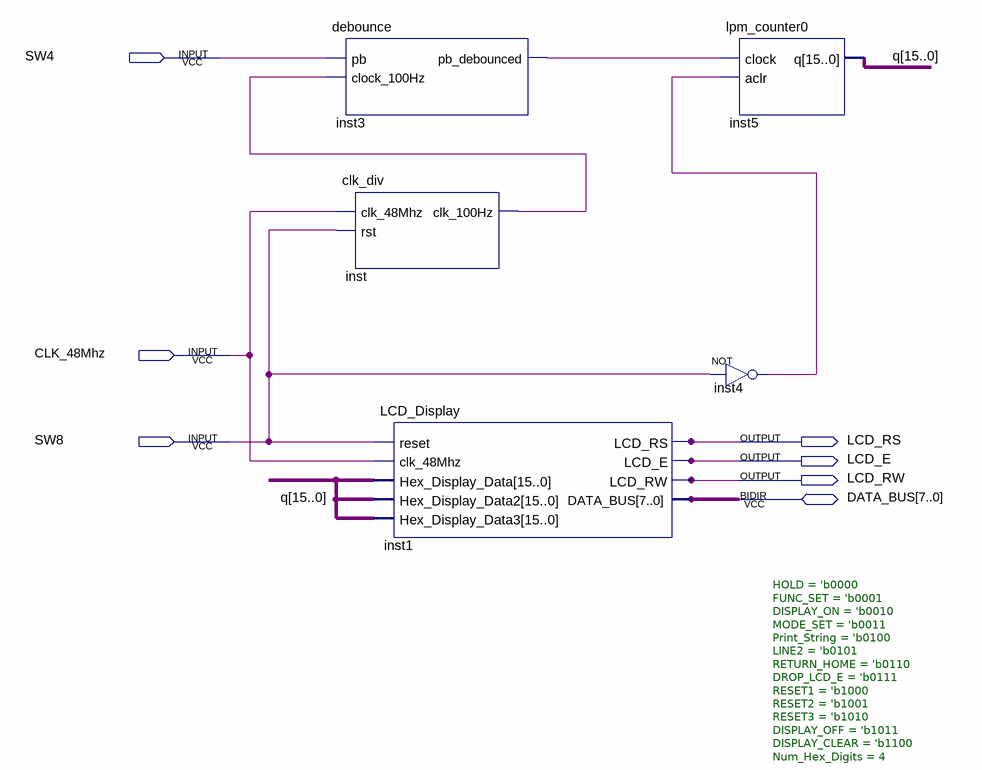
[diagram p0: schematic sheet]
// Quartus schematic tutor3.bdf as structural Verilog: 5 symbols, 7 pins
module tutor3 (
  input  SW4,
  input  CLK_48Mhz,
  input  SW8,
  inout  [7:0] DATA_BUS,
  output LCD_RS,
  output LCD_E,
  output LCD_RW
);

  wire inst3_pb_debounced, inst4_out, inst_clk_100hz;
  wire [15:0] q;

  debounce inst3 (.pb(SW4), .clock_100Hz(inst_clk_100hz), .pb_debounced(inst3_pb_debounced));
  clk_div inst (.clk_48Mhz(CLK_48Mhz), .rst(SW8), .clk_100Hz(inst_clk_100hz));
  LCD_Display #(.HOLD('b0000), .FUNC_SET('b0001), .DISPLAY_ON('b0010), .MODE_SET('b0011), .Print_String('b0100), .LINE2('b0101), .RETURN_HOME('b0110), .DROP_LCD_E('b0111), .RESET1('b1000), .RESET2('b1001), .RESET3('b1010), .DISPLAY_OFF('b1011), .DISPLAY_CLEAR('b1100), .Num_Hex_Digits(4)) inst1 (
    .reset(SW8), .clk_48Mhz(CLK_48Mhz), .Hex_Display_Data(q), .Hex_Display_Data2(q), .Hex_Display_Data3(q),
    .LCD_RS(LCD_RS), .LCD_E(LCD_E), .LCD_RW(LCD_RW), .DATA_BUS(DATA_BUS));
  lpm_counter0 inst5 (.clock(inst3_pb_debounced), .aclr(inst4_out), .q(q));
  not inst4 (inst4_out, SW8);
endmodule
